# EAGLE design schematic_3 (EAGLE 8.7.0)
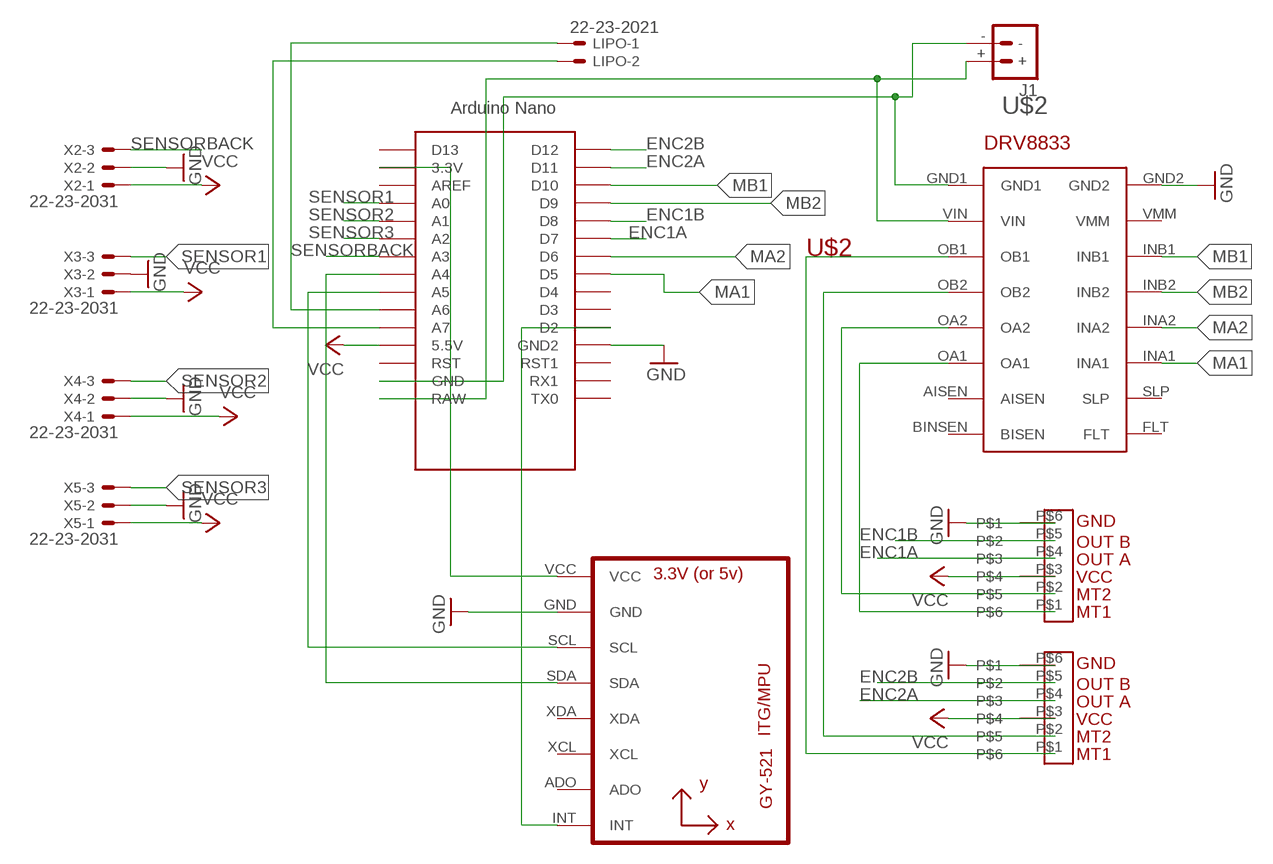
[diagram p0: schematic, sheet 1]

## Parts
J1  BATTERY_CONN_DEANS  [DEANS]
LIPO  22-23-2021  [22-23-2021]
U1  GY-521MPU6050  [GY-521]
U$1  NANO  [NANO]
U$2  POLOLU-DRV8833  [POLOLU-DRV8833]
U$5  MOTOR  [PINHEADER]
U$6  MOTOR  [PINHEADER]
X2  22-23-2031  [22-23-2031]
X3  22-23-2031  [22-23-2031]
X4  22-23-2031  [22-23-2031]
X5  22-23-2031  [22-23-2031]

## Nets
ENC1A: U$1.D7 U$5.P$4
ENC1B: U$1.D8 U$5.P$5
ENC2A: U$1.D11 U$6.P$4
ENC2B: U$1.D12 U$6.P$5
GND: U1.GND U$1.GND1(GND2) U$2.GND2 U$5.P$6 U$6.P$6 X2.2 X3.2 X4.2 X5.2
MA1: U$1.D5 U$2.INA1
MA2: U$1.D6 U$2.INA2
MB1: U$1.D10 U$2.INB1
MB2: U$1.D9 U$2.INB2
N$1: J1.- U$1.GND U$2.GND1
N$2: J1.+ U$1.RAW U$2.VIN
N$3: LIPO.1 U$1.A6
N$4: LIPO.2 U$1.A7
N$5: U1.VCC U$1.3.3V
N$6: U1.SCL U$1.A5
N$7: U1.SDA U$1.A4
N$8: U$2.OA2 U$5.P$2
N$11: U$2.OA1 U$5.P$1
N$12: U$2.OB2 U$6.P$2
N$13: U$2.OB1 U$6.P$1
N$14: U1.INT U$1.D2
SENSOR1: U$1.A0 X3.3
SENSOR2: U$1.A1 X4.3
SENSOR3: U$1.A2 X5.3
SENSORBACK: U$1.A3 X2.3
VCC: U$1.5V(5.5V) U$5.P$3 U$6.P$3 X2.1 X3.1 X4.1 X5.1
Unconnected: U1.ADO U1.XCL U1.XDA U$1.AREF U$1.D3 U$1.D4 U$1.D13 U$1.ICSP1 U$1.ICSP2 U$1.ICSP3 U$1.ICSP4 U$1.ICSP5 U$1.ICSP6 U$1.RST U$1.RST1 U$1.RX1 U$1.TX0 U$2.AISEN U$2.BINSEN(BISEN) U$2.FLT U$2.SLP U$2.VMM

## Library data of the parts
J1 = SparkFun-Connectors:BATTERY_CONN: Battery Connectors Various footprints for battery connections SparkFun Products: Deans Connector -M/F Pair <https://www.sparkfun.com/products/11864>; SF_ID: PRT-11864
LIPO = con-molex:22-23-2021: .100" (2.54mm) Center Header - 2 Pin; MF: MOLEX; MPN: 22-23-2021; OC_FARNELL: 1462926; OC_NEWARK: 25C3832
U1 = gy-521:GY-521
U$1 = Arduino-clone:NANO: Arduino Nano
U$2 = Pololu_Driver_DRV8833:POLOLU-DRV8833: Created by: Deltarios DRV8833 pololu dual drive controller, PCB-ready device
U$5 U$6 = pololu encoder board:MOTOR
X2-X5 = con-molex:22-23-2031: .100" (2.54mm) Center Header - 3 Pin; MF: MOLEX; MPN: 22-23-2031; OC_FARNELL: 1462950; OC_NEWARK: 30C0862

## Net classes
0 default: width 0.254 mm, drill 0.254 mm, clearance 0.508 mm

## Board
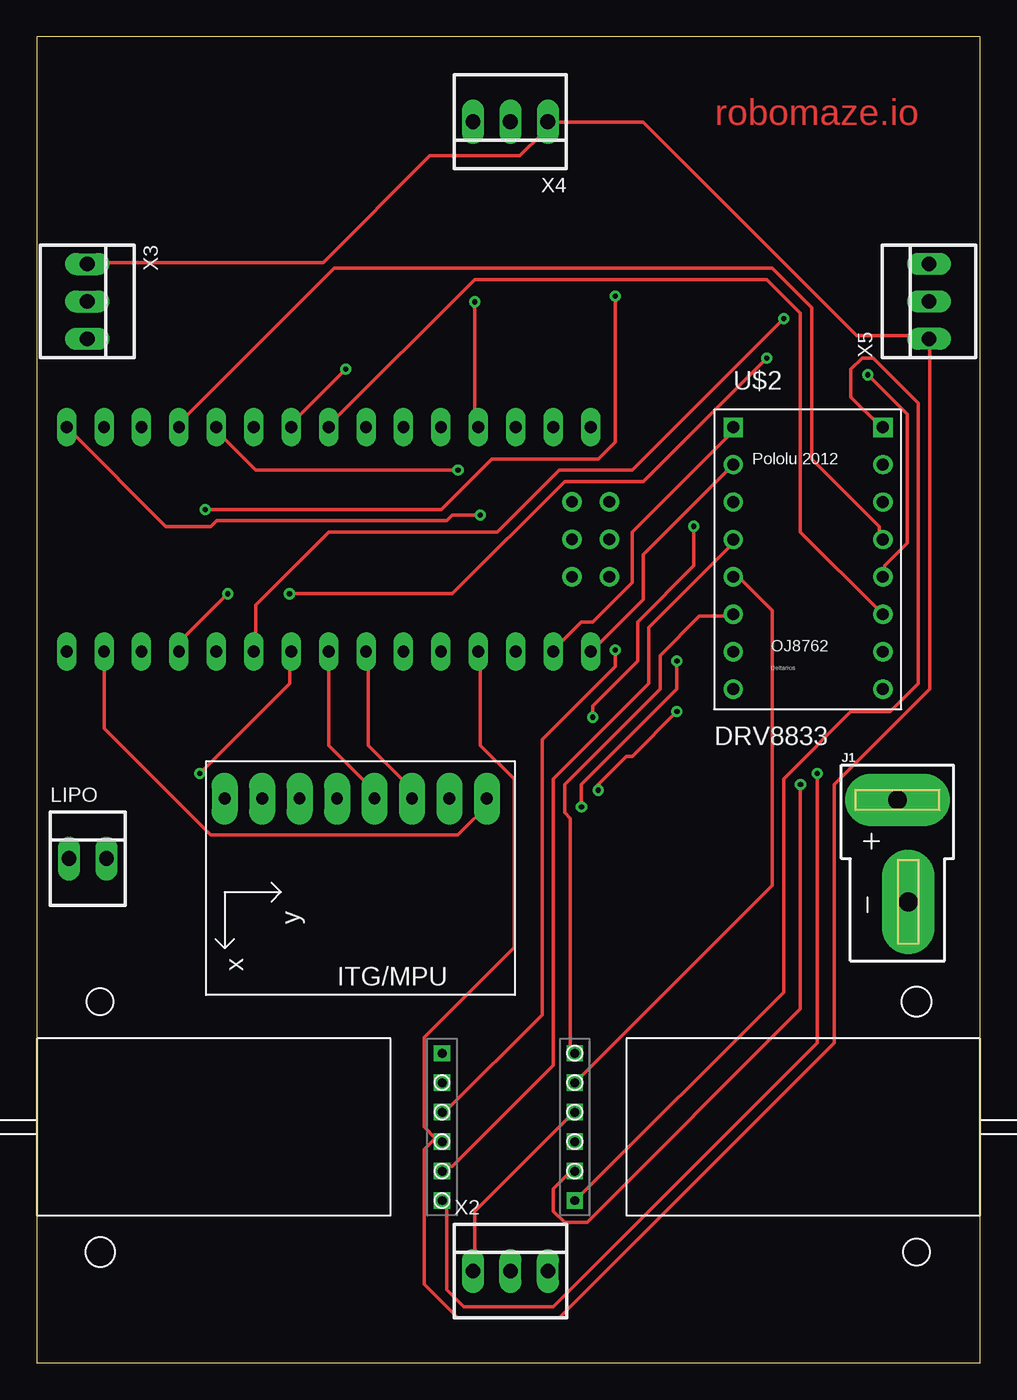
[diagram p1: board, top side]
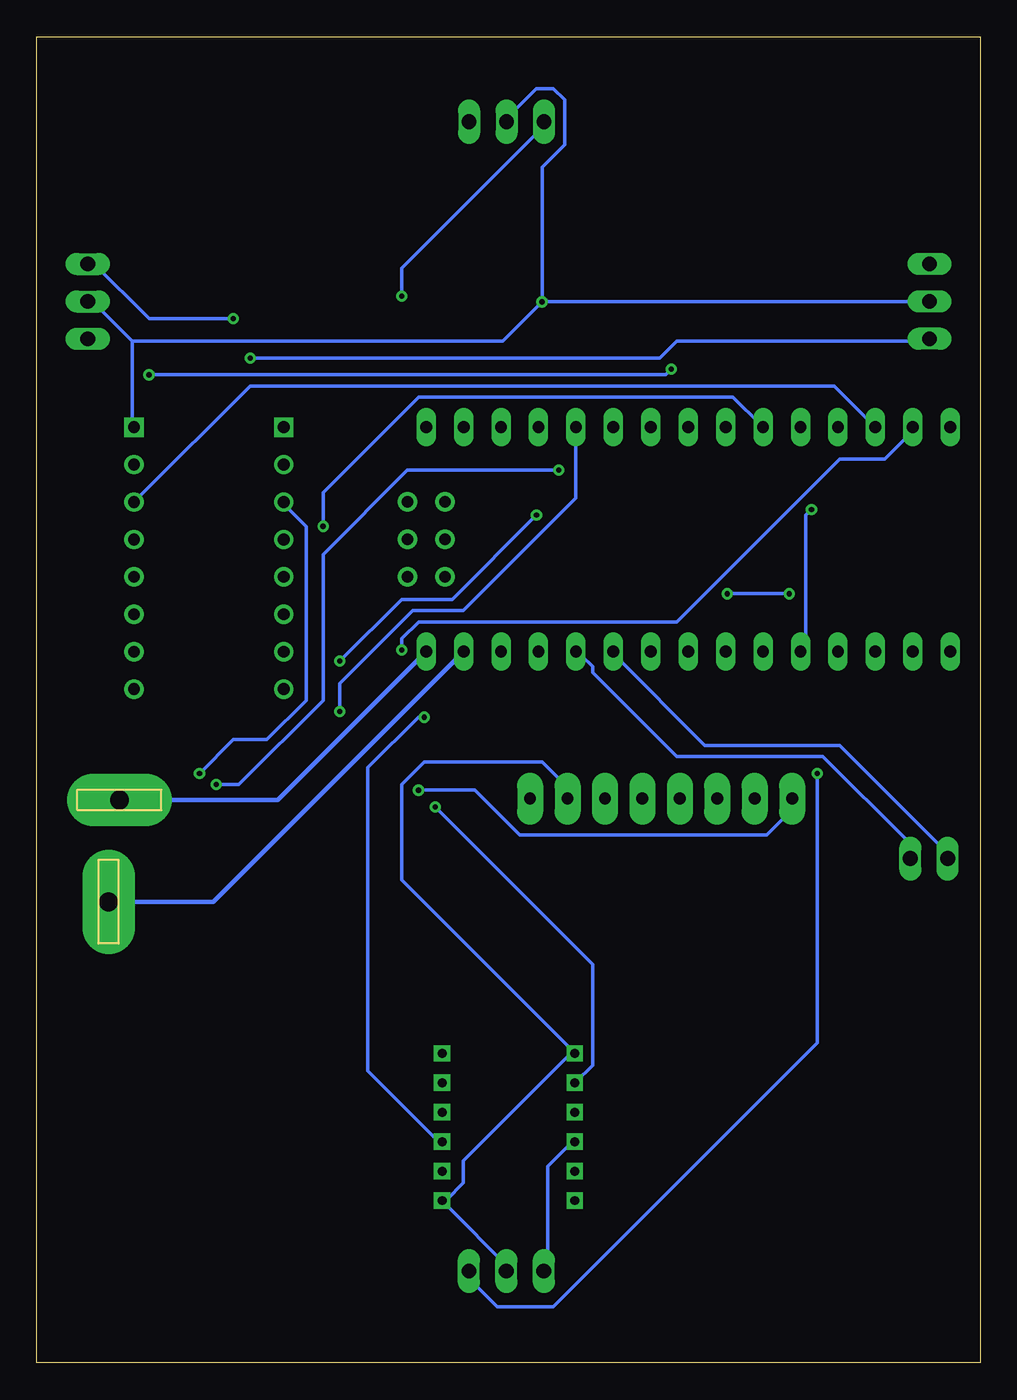
[diagram p2: board, bottom side, seen from below]

Size 64 x 90 mm. Coordinates in mm from the lower left corner, seen from the top.
Outline: 0,0 64,0 64,90 0,90 0,0
Copper layers (1*16): Top 0.035mm / dielectric 1.5mm / Bottom 0.035mm
Design rules "default": minimum track width 6mil, minimum drill 0.35mm, track to track 6mil, track to pad 6mil, pad to pad 6mil, via to via 6mil, smd to smd 6mil, copper to edge 40mil, drill to drill 6mil, minimum pad ring 10mil, minimum via ring 8mil, stop-mask expansion 4mil, vias tented up to drill 0mil, thermal gap 10mil

### Footprints (pad centres in the part's own frame; a part is rotated, then mirrored left to right if it is on the bottom)
DEANS = drill 1.27 pad 3.556 long: + 0,0; - 0.737,-6.921
22-23-2021 = drill 1 long: 1 -1.27,0; 2 1.27,0
GY-521 = drill 0.8 pad 1.778 long: ADO -8.89,-6.35; GND -8.89,6.35; INT -8.89,-8.89; SCL -8.89,3.81; SDA -8.89,1.27; VCC -8.89,8.89; XCL -8.89,-3.81; XDA -8.89,-1.27
NANO = drill 0.8 long: 3.3V -10.16,24.13; 5V -10.16,-1.27; A0 -10.16,19.05; A1 -10.16,16.51; A2 -10.16,13.97; A3 -10.16,11.43; A4 -10.16,8.89; A5 -10.16,6.35; A6 -10.16,3.81; A7 -10.16,1.27; AREF -10.16,21.59; D2 5.08,1.27; D3 5.08,3.81; D4 5.08,6.35; D5 5.08,8.89; D6 5.08,11.43; D7 5.08,13.97; D8 5.08,16.51; D9 5.08,19.05; D10 5.08,21.59; D11 5.08,24.13; D12 5.08,26.67; D13 -10.16,26.67; GND -10.16,-6.35; GND1 5.08,-1.27; RAW -10.16,-8.89; RST -10.16,-3.81; RST1 5.08,-3.81; RX1 5.08,-6.35; TX0 5.08,-8.89 | drill 0.8: ICSP1 -5.08,-10.16; ICSP2 -5.08,-7.62; ICSP3 -2.54,-10.16; ICSP4 -2.54,-7.62; ICSP5 0,-10.16; ICSP6 0,-7.62
POLOLU-DRV8833 = drill 0.8: AISEN -3.81,-7.62; BINSEN -3.81,-10.16; FLT 6.35,-10.16; INA1 6.35,-5.08; INA2 6.35,-2.54; INB1 6.35,2.54; INB2 6.35,0; OA1 -3.81,-5.08; OA2 -3.81,-2.54; OB1 -3.81,2.54; OB2 -3.81,0; SLP 6.35,-7.62; VIN -3.81,5.08; VMM 6.35,5.08 | drill 0.8 square: GND1 -3.81,7.62; GND2 6.35,7.62
PINHEADER = drill 0.6 square: P$1 0.5,0.5; P$2 2.5,0.5; P$3 4.5,0.5; P$4 6.5,0.5; P$5 8.5,0.5; P$6 10.5,0.5
22-23-2031 = drill 1 long: 1 -2.54,0; 2 0,0; 3 2.54,0

### Placement (x,y rotation side)
J1  58.4,38.2 0 top
LIPO  3.46,34.22 0 top
U1  21.64,29.4 270 top
U$1  28.69,58.43 90 top
U$2  51.06,55.88 0 top
U$5  36,21.5 270 top
U$6  28,10.5 90 top
X2  32.14,6.22 0 top
X3  3.42,72.04 270 top
X4  32.13,84.24 180 top
X5  60.54,72.04 90 top

### Tracks (layer width: path | path; a pad name or v marks a point on that pad's centre or on a via)
ENC1A  (via drill 0.35)
  Top 0.254: v37.72,43.81 37.72,44.58 40.77,47.62 40.77,50.29 44.58,54.1 v44.58,56.77
  Bottom 0.254: v37.72,43.81 38.1,43.81 41.53,40.39 41.53,19.81 36.96,15.24 36.58,15.24 U$5.P$4 | v44.58,56.77 44.58,59.05 38.1,65.53 16.76,65.53 14.86,63.63 U$1.D7
ENC1B  (via drill 0.35)
  Top 0.254: v51.82,39.24 51.82,24 37.34,9.53 35.81,9.53 35.05,10.29 35.05,11.81 36.2,12.95 U$5.P$5 | v28.57,60.58 14.86,60.58 12.19,63.25 U$1.D8
  Bottom 0.254: v51.82,39.24 50.29,39.24 44.58,44.96 44.58,54.86 38.86,60.58 v28.57,60.58
ENC2A  (via drill 0.35)
  Top 0.254: v39.24,48.39 39.24,47.24 34.29,42.29 34.29,23.62 27.81,17.14 U$6.P$4
  Bottom 0.254: v39.24,48.39 39.24,49.15 38.1,50.29 20.57,50.29 9.53,61.34 6.48,61.34 4.57,63.25 U$1.D11
ENC2B  (via drill 0.35)
  Top 0.254: v36.96,37.72 36.96,39.24 43.43,45.72 v43.43,47.62 | v30.1,57.53 28.19,57.53 27.81,57.15 12.19,57.15 11.81,56.77 8.76,56.77 2.29,63.25 U$1.D12
  Bottom 0.254: v36.96,37.72 26.29,27.05 26.29,20.19 27.43,19.05 U$6.P$5 | v43.43,47.62 39.24,51.82 35.81,51.82 v30.1,57.53
GND  (via drill 0.35)
  Top 0.254: v29.72,72.01 29.72,63.63 U$1.GND1 | U$5.P$6 36.58,11.05 50.67,25.15 50.67,39.62 55.24,44.2 57.91,44.2 59.82,46.1 59.82,65.15 56.77,68.2 56.01,68.2 55.24,67.44 55.24,65.53 57.15,63.63 U$2.GND2
  Bottom 0.254: X2.2 32,6.48 36.2,10.67 U$5.P$6 36.2,11.05 35.05,12.19 35.05,13.72 27.81,20.95 U$6.P$6 27.81,21.34 39.24,32.77 39.24,39.24 37.72,40.77 29.72,40.77 28.19,39.24 28.19,38.48 U1.GND | 57.53,69.34 57.53,63.63 U$2.GND2 | 57.53,69.34 60.2,72.01 X5.2 | v29.72,72.01 29.72,81.15 28.19,82.68 28.19,85.72 28.96,86.49 30.1,86.49 32,84.58 X4.2 | v29.72,72.01 3.43,72.01 X3.2 | 57.53,69.34 32.38,69.34 v29.72,72.01
MA1
  Top 0.254: U$2.INA1 57.15,51.05 51.82,56.39 51.82,71.25 49.53,73.53 29.72,73.53 19.81,63.63 U$1.D5
MA2  (via drill 0.35)
  Top 0.254: v56.39,67.06 59.05,64.39 59.05,55.63 57.53,54.1 57.53,53.34 U$2.INA2 | v20.95,67.44 17.14,63.63 U$1.D6
  Bottom 0.254: v56.39,67.06 21.34,67.06 v20.95,67.44
MB1
  Bottom 0.254: U$1.D10 7.24,63.63 9.91,66.29 49.53,66.29 57.15,58.67 U$2.INB1
MB2
  Top 0.254: U$2.INB2 57.15,56.01 57.15,56.77 52.58,61.34 52.58,71.63 49.91,74.3 20.19,74.3 9.53,63.63 U$1.D9
N$1
  Top 0.254: U$2.GND1 47.24,63.25 40.39,56.39 40.39,52.96 37.72,50.29 36.96,50.29 35.05,48.39 U$1.GND
  Bottom 0.305: J1.- 52.03,31.28 U$1.GND
N$2
  Top 0.254: U$2.VIN 41.15,54.86 41.15,51.82 37.72,48.39 U$1.RAW
  Bottom 0.305: J1.+ 47.65,38.2 U$1.RAW
N$3
  Bottom 0.254: U$1.A6 24.77,48.01 18.67,41.91 9.53,41.91 1.91,34.29 LIPO.1
N$4
  Bottom 0.254: U$1.A7 27.05,48.01 26.29,47.24 26.29,46.86 20.57,41.15 10.67,41.15 4.95,35.43 4.95,34.29 LIPO.2
N$5
  Top 0.254: U$1.3.3V 4.57,48.01 4.57,43.05 11.81,35.81 28.57,35.81 30.86,38.1 U1.VCC
N$6
  Top 0.254: U$1.A5 22.48,48.01 22.48,41.91 25.15,39.24 25.15,38.48 U1.SCL
N$7
  Top 0.254: U$1.A4 19.81,48.01 19.81,41.91 23.24,38.48 U1.SDA
N$8
  Top 0.254: U$5.P$2 36.58,19.05 49.91,32.38 49.91,51.05 47.62,53.34 U$2.OA2
N$11
  Top 0.254: U$5.P$1 36.2,21.34 36.2,36.96 35.81,37.34 35.81,39.24 42.29,45.72 42.29,48.01 44.96,50.67 47.24,50.67 U$2.OA1
N$12
  Top 0.254: U$6.P$2 27.81,13.34 28.19,13.34 35.05,20.19 35.05,39.62 41.53,46.1 41.53,49.91 47.24,55.63 U$2.OB2
N$13  (via drill 0.35)
  Top 0.254: v52.96,40.01 52.96,21.72 35.05,3.81 28.96,3.81 27.81,4.95 27.81,10.67 U$6.P$1
  Bottom 0.254: v52.96,40.01 50.67,42.29 48.39,42.29 45.72,44.96 45.72,56.77 47.24,58.29 U$2.OB1
N$14  (via drill 0.35)
  Top 0.254: v43.43,44.2 40.39,41.15 40.01,41.15 38.1,39.24 v38.1,38.86
  Bottom 0.254: v43.43,44.2 43.43,46.1 38.48,51.05 35.05,51.05 27.43,58.67 27.43,63.25 U$1.D2 | v38.1,38.86 34.29,38.86 31.24,35.81 14.48,35.81 12.95,37.34 12.95,38.1 U1.INT
SENSOR1  (via drill 0.35)
  Top 0.254: v12.95,52.2 9.91,49.15 9.91,48.39 U$1.A0 | v17.14,52.2 28.19,52.2 35.81,59.82 41.15,59.82 v49.53,68.2
  Bottom 0.254: v17.14,52.2 v12.95,52.2 | v49.53,68.2 21.72,68.2 20.57,69.34 3.43,69.34 X3.3
SENSOR2  (via drill 0.35)
  Top 0.254: v11.43,57.91 27.43,57.91 30.86,61.34 38.1,61.34 39.24,62.48 v39.24,72.39
  Bottom 0.254: v11.43,57.91 11.81,57.53 11.81,48.39 U$1.A1 | v39.24,72.39 39.24,74.3 29.34,84.2 X4.3
SENSOR3  (via drill 0.35)
  Top 0.254: v50.67,70.87 40.39,60.58 35.43,60.58 31.24,56.39 19.81,56.39 14.86,51.44 14.86,48.39 U$1.A2
  Bottom 0.254: v50.67,70.87 56.39,70.87 60.2,74.68 X5.3
SENSORBACK  (via drill 0.35)
  Top 0.254: v11.05,40.01 17.14,46.1 17.14,48.01 U$1.A3
  Bottom 0.254: v11.05,40.01 11.05,21.72 28.96,3.81 32.77,3.81 35.05,6.1 X2.3
VCC
  Top 0.254: U$5.P$3 36.2,16.76 29.72,10.29 29.72,6.48 X2.1 | 27.05,15.24 27.43,14.86 U$6.P$3 27.05,15.24 | 27.05,15.24 26.29,16 26.29,22.1 32.38,28.19 32.38,39.62 30.1,41.91 30.1,48.01 U$1.5V | X3.1 3.43,74.68 19.43,74.68 26.67,81.92 32.77,81.92 34.29,83.44 34.29,84.2 X4.1 34.67,84.2 41.15,84.2 55.63,69.72 60.2,69.72 X5.1 60.58,69.34 60.58,45.72 54.1,39.24 54.1,21.72 35.43,3.05 28.57,3.05 26.29,5.33 26.29,14.48 27.05,15.24
  Bottom 0.254: U$6.P$3 27.81,14.86 29.34,13.34 29.34,6.48 X2.1

### Text on the board
Top: robomaze.io